# Altium project Power Board V1.PrjPcb
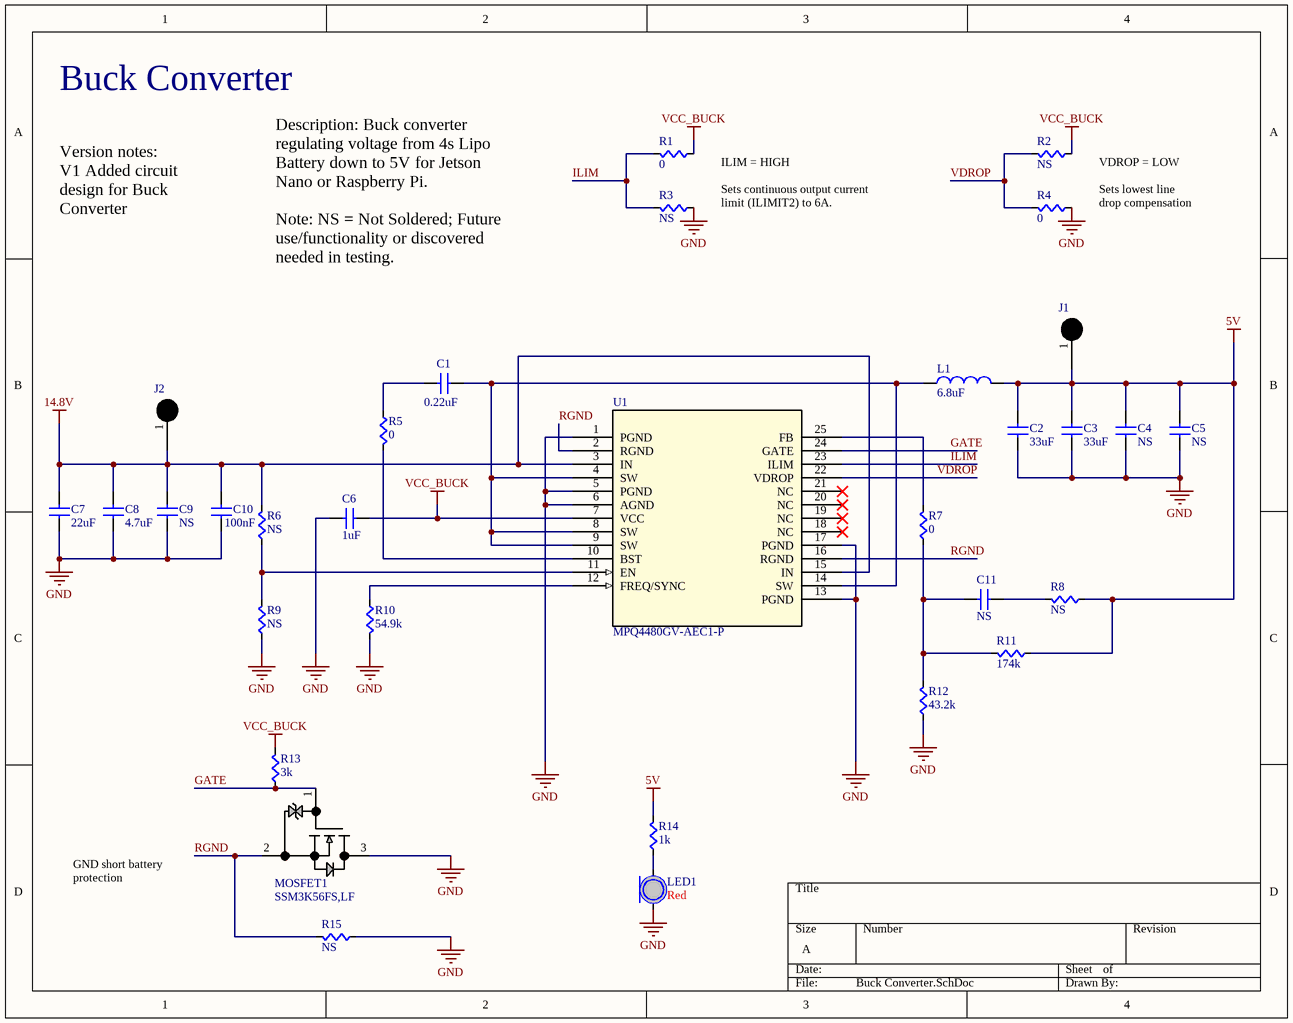
[diagram p0: Buck Converter.SchDoc]
3 sheets, 56 parts. Net scope: global (net labels, ports and power ports of the same name join across sheets).
Board file: Power Board V2.PcbDoc
Sheets:
  Buck Converter.SchDoc
  Battery Management System.SchDoc
  Board Connector.SchDoc

## Sheet Buck Converter.SchDoc
size A; SheetNumber: 1; SheetTotal: 3

### Parts
C1  value 0.22uF  [CAPC0603]  (hidden comment: C1608X7R1H224K080AE)
C2  value 33uF  [CAP1210]  (hidden comment: C3225X5R1A336M200AC)
C3  value 33uF  [CAP1210]  (hidden comment: C3225X5R1A336M200AC)
C4  value NS  [CAPC1206]  (hidden comment: Cap)
C5  value NS  [CAPC1206]  (hidden comment: Cap)
C6  value 1uF  [CAPC0603]  (hidden comment: CL10A105KB8NNNC)
C7  value 22uF  [CAPC1206]  (hidden comment: CL31A226KAHNNNE)
C8  value 4.7uF  [CAPC1206]  (hidden comment: 885012208094)
C9  value NS  [CAPC1206]  (hidden comment: Cap)
C10  value 100nF  [CAPC0603]  (hidden comment: CL10B104KB8NNNC)
C11  value NS  [CAPC0603]  (hidden comment: Cap)
J1  5000 Test Point  [5000 Test Point]  (value not drawn)
J2  5000 Test Point  [5000 Test Point]  (value not drawn)
L1  Inductance: 6.8uF  [SRR1208 Series]  (hidden comment: SRR1280A-6R8Y)
LED1  Color: Red  [LED1206]  (hidden comment: LED)
MOSFET1  SSM3K56FS,LF  [SSM_TOS]
R1  value 0  [RES0603]  (hidden comment: RMCF0603ZT0R00)
R2  value NS  [RES0603]  (hidden comment: Res)
R3  value NS  [RES0603]  (hidden comment: Res)
R4  value 0  [RES0603]  (hidden comment: RMCF0603ZT0R00)
R5  value 0  [RES0603]  (hidden comment: RMCF0603ZT0R00)
R6  value NS  [RES0603]  (hidden comment: Res)
R7  value 0  [RES0603]  (hidden comment: RMCF0603ZT0R00)
R8  value NS  [RES0603]  (hidden comment: Res)
R9  value NS  [RES0603]  (hidden comment: Res)
R10  value 54.9k  [RES0603]  (hidden comment: RMCF0603FT54K9)
R11  value 174k  [RES0603]  (hidden comment: RC0603FR-07174KL)
R12  value 43.2k  [RES0603]  (hidden comment: RC0603FR-0743K2L)
R13  value 3k  [RES0603]  (hidden comment: RMCF0603FT3K00)
R14  value 1k  [RES0603]  (hidden comment: RC0603FR-071KL)
R15  value NS  [RES0603]  (hidden comment: Res)
U1  MPQ4480GV-AEC1-P  [QFN-25_4X5_MNP]

### Nets
5V: C2.1(A) C3.1(A) C4.1(A) C5.1(A) J1.1 L1.2(B) R8.2(B) R11.2(B) R14.1(A)
14.8V: C7.1(A) C8.1(A) C9.1(A) C10.1(A) J2.1 R6.1(A) U1.3(IN) U1.15(IN)
GND: C2.2(B) C3.2(B) C4.2(B) C5.2(B) C6.2(B) C7.2(B) C8.2(B) C9.2(B) C10.2(B) LED1.C MOSFET1.3 R3.2(B) R4.2(B) R9.2(B) R10.1(A) R12.2(B) R15.2(B) U1.1(PGND) U1.5(PGND) U1.6(AGND) U1.13(PGND) U1.17(PGND)
VCC_BUCK: C6.1(A) R1.2(B) R2.2(B) R13.1(A) U1.7(VCC)
GATE: MOSFET1.1 R13.2(B) U1.24(GATE)
ILIM: R1.1(A) R3.1(A) U1.23(ILIM)
RGND: MOSFET1.2 R15.1(A) U1.2(RGND) U1.16(RGND)
VDROP: R2.1(A) R4.1(A) U1.22(VDROP)
NetC1_1: C1.1(A) R5.2(B)
NetC1_2: C1.2(B) L1.1(A) U1.4(SW) U1.8(SW) U1.9(SW) U1.14(SW)
NetC11_1: C11.1(A) R7.2(B) R11.1(A) R12.1(A)
NetC11_2: C11.2(B) R8.1(A)
NetLED1_A: LED1.A R14.2(B)
NetR5_1: R5.1(A) U1.10(BST)
NetR6_2: R6.2(B) R9.1(A) U1.11(EN)
NetR7_1: R7.1(A) U1.25(FB)
NetR10_2: R10.2(B) U1.12(FREQ/SYNC)

Not connected (* = marked no-connect by the designer): U1 18(NC)* 19(NC)* 20(NC)* 21(NC)*

### Notes on the sheet
- Buck Converter
- ILIM = HIGH
  Sets continuous output current limit (ILIMIT2) to 6A.
- VDROP = LOW
  Sets lowest line drop compensation
- Version notes:
  V1 Added circuit design for Buck Converter
- Description: Buck converter regulating voltage from 4s Lipo Battery down to 5V for Jetson Nano or Raspberry Pi.
  Note: NS = Not Soldered; Future use/functionality or discovered needed in testing.
- GND short battery protection

### Library data of the parts
C1 = C1608X7R1H224K080AE: 0.22 µF ±10% 50V Ceramic Capacitor X7R 0603 (1608 Metric); Supplier 1: Arrow Electronics; Supplier Part Number 1: C1608X7R1H224K080AE; ComponentLink1Description: New link; ComponentLink1URL: *
C2 C3 = C3225X5R1A336M200AC: 33 µF ±20% 10V Ceramic Capacitor X5R 1210 (3225 Metric); Supplier 1: Arrow Electronics; Supplier Part Number 1: C3225X5R1A336M200AC; ComponentLink1Description: New link; ComponentLink1URL: *
C6 = CL10A105KB8NNNC: 1 µF ±10% 50V Ceramic Capacitor X5R 0603 (1608 Metric); Supplier 1: Arrow Electronics; Supplier Part Number 1: CL10A105KB8NNNC; ComponentLink1Description: New link; ComponentLink1URL: *
C7 = CL31A226KAHNNNE: 22 µF ±10% 25V Ceramic Capacitor X5R 1206 (3216 Metric); Supplier 1: Arrow Electronics; Supplier Part Number 1: CL31A226KAHNNNE; ComponentLink1Description: New link; ComponentLink1URL: *
C8 = 885012208094: 4.7 µF ±10% 50V Ceramic Capacitor X7R 1206 (3216 Metric); Supplier 1: Digi-Key; Supplier Part Number 1: 732-7578-1-ND; ComponentLink1Description: New link; ComponentLink1URL: *
C9 = Cap: Not Soldered (NS); ComponentLink1Description: New link; ComponentLink1URL: *
C10 = CL10B104KB8NNNC: 0.1 µF ±10% 50V Ceramic Capacitor X7R 0603 (1608 Metric); Supplier 1: Arrow Electronics; Supplier Part Number 1: CL10B104KB8NNNC; ComponentLink1Description: New link; ComponentLink1URL: *
L1 = SRR1280A-6R8Y: FIXED IND 6.8UH 7.6A 18.5MOHM SM; Manufacturer 1: Bourns Inc; Manufacturer Part Number 1: SRR1280A-6R8Y; Supplier 1: Newark; Supplier Part Number 1: 87X9503
MOSFET1 = SSM3K56FS,LF: No Description Available; Mfr_Name: Toshiba Electronic Devices & Storage Corp.; Copyright: Copyright (C) 2023 Ultra Librarian. All rights reserved.; Manufacturer_Part_Number: SSM3K56FS,LF; RefDes: RefDes; Type: DEV
R1 R4 R5 R7 = RMCF0603ZT0R00: 0 Ohms Jumper Chip Resistor 0603 (1608 Metric) Automotive AEC-Q200 Thick Film; Supplier 1: Arrow Electronics; Supplier Part Number 1: RMCF0603ZT0R00
R10 = RMCF0603FT54K9: 54.9 kOhms ±1% 0.1W, 1/10W Chip Resistor 0603 (1608 Metric) Automotive AEC-Q200 Thick Film; Supplier 1: Arrow Electronics; Supplier Part Number 1: RMCF0603FT54K9
R11 = RC0603FR-07174KL: 174 kOhms ±1% 0.1W, 1/10W Chip Resistor 0603 (1608 Metric) Moisture Resistant Thick Film; Supplier 1: Future Electronics; Supplier Part Number 1: 4022323
R12 = RC0603FR-0743K2L: 43.2 kOhms ±1% 0.1W, 1/10W Chip Resistor 0603 (1608 Metric) Moisture Resistant Thick Film; Supplier 1: Future Electronics; Supplier Part Number 1: 3526589
R13 = RMCF0603FT3K00: 3 kOhms ±1% 0.1W, 1/10W Chip Resistor 0603 (1608 Metric) Automotive AEC-Q200 Thick Film; Supplier 1: Arrow Electronics; Supplier Part Number 1: RMCF0603FT3K00
R14 = RC0603FR-071KL: 1 kOhms ±1% 0.1W, 1/10W Chip Resistor 0603 (1608 Metric) Moisture Resistant Thick Film; Supplier 1: Future Electronics; Supplier Part Number 1: 4016291; Parameter 1: *
U1 = MPQ4480GV-AEC1-P: No Description Available; Mfr_Name: Monolithic Power Systems; Copyright: Copyright (C) 2023 Ultra Librarian. All rights reserved.; Manufacturer_Part_Number: MPQ4480GV-AEC1-P; Digi-Key_Part_Number_1: 1589-MPQ4480GV-AEC1-PTR-ND; Digi-Key_Part_Number_2: 1589-MPQ4480GV-AEC1-PCT-ND; Digi-Key_Part_Number_3: 1589-MPQ4480GV-AEC1-PDKR-ND; RefDes: RefDes; Type: DEV
C4 C5 C11 = Cap: Supplier 1: Digi-Key; Supplier Part Number 1: 1276-1000-1-ND; ComponentLink1Description: New link; ComponentLink1URL: *
LED1 = LED: Supplier 1: Digi-Key; Supplier Part Number 1: 1080-1419-1-ND
R2 R3 R6 R8 R9 R15 = Res: Supplier 1: Digi-Key; Supplier Part Number 1: RMCF0603JT10K0CT-ND

## Sheet Battery Management System.SchDoc
size A; SheetNumber: 2; SheetTotal: 3
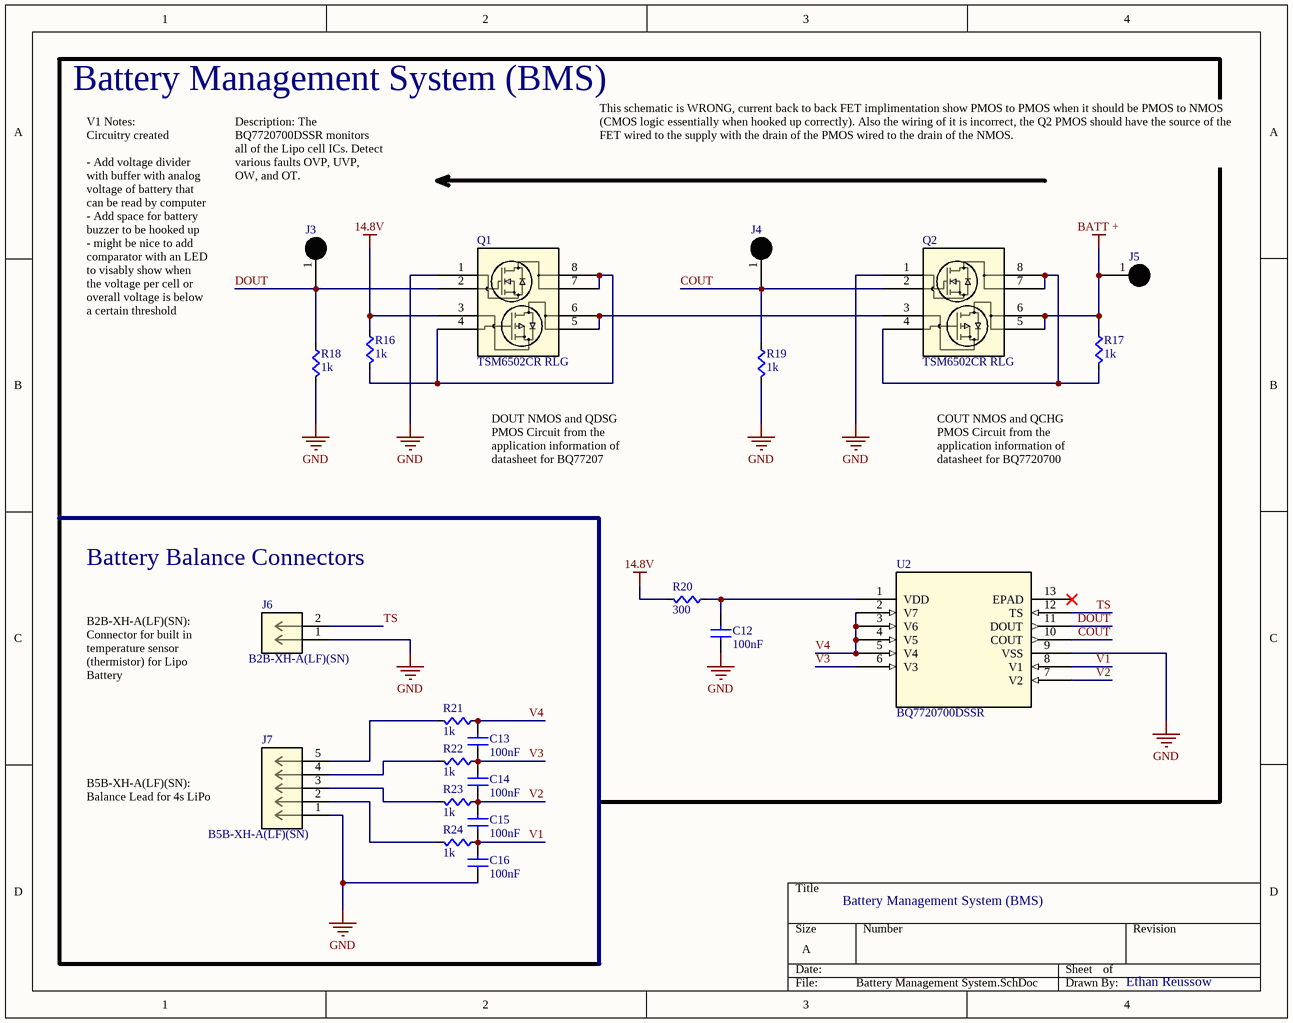
[diagram p1: Battery Management System.SchDoc]

### Parts
C12  value 100nF  [CAPC0603]  (hidden comment: Cap)
C13  value 100nF  [CAPC0603]  (hidden comment: Cap)
C14  value 100nF  [CAPC0603]  (hidden comment: Cap)
C15  value 100nF  [CAPC0603]  (hidden comment: Cap)
C16  value 100nF  [CAPC0603]  (hidden comment: Cap)
J3  5000 Test Point  [5000 Test Point]  (value not drawn)
J4  5000 Test Point  [5000 Test Point]  (value not drawn)
J5  5000 Test Point  [5000 Test Point]  (value not drawn)
J6  B2B-XH-A(LF)(SN)  [CONN_B2B-XH-A(LF)(SN)_JST]
J7  B5B-XH-A(LF)(SN)  [CONN_B5B-XH-A(LF)(SN)_JST]
Q1  TSM6502CR RLG  [PDFN56U_DUAL_TWS]
Q2  TSM6502CR RLG  [PDFN56U_DUAL_TWS]
R16  value 1k  [RES0603]  (hidden comment: Res)
R17  value 1k  [RES0603]  (hidden comment: Res)
R18  value 1k  [RES0603]  (hidden comment: Res)
R19  value 1k  [RES0603]  (hidden comment: Res)
R20  value 300  [RES0603]  (hidden comment: Res)
R21  value 1k  [RES0603]  (hidden comment: Res)
R22  value 1k  [RES0603]  (hidden comment: Res)
R23  value 1k  [RES0603]  (hidden comment: Res)
R24  value 1k  [RES0603]  (hidden comment: Res)
U2  BQ7720700DSSR  [WSON12_DSS_TEX]

### Nets
14.8V: Q1.3 R16.2(B) R20.1(A)
BATT +: J5.1 Q2.5 Q2.6 R17.2(B)
GND: C12.2(B) C16.2(B) J6.1 J7.1 Q1.1 Q2.1 R18.1(A) R19.1(A) U2.9(VSS)
COUT: J4.1 Q2.2 R19.2(B) U2.10(COUT)
DOUT: J3.1 Q1.2 R18.2(B) U2.11(DOUT)
TS: J6.2 U2.12(TS)
V1: C15.2(B) C16.1(A) R24.2(B) U2.8(V1)
V2: C14.2(B) C15.1(A) R23.2(B) U2.7(V2)
V3: C13.2(B) C14.1(A) R22.2(B) U2.6(V3)
V4: C13.1(A) R21.2(B) U2.2(V7) U2.3(V6) U2.4(V5) U2.5(V4)
NetC12_1: C12.1(A) R20.2(B) U2.1(VDD)
NetJ7_2: J7.2 R24.1(A)
NetJ7_3: J7.3 R23.1(A)
NetJ7_4: J7.4 R22.1(A)
NetJ7_5: J7.5 R21.1(A)
NetQ1_4: Q1.4 Q1.7 Q1.8 R16.1(A)
NetQ1_5: Q1.5 Q1.6 Q2.3
NetQ2_4: Q2.4 Q2.7 Q2.8 R17.1(A)

Not connected (* = marked no-connect by the designer): U2 13(EPAD)*

### Notes on the sheet
- Battery Management System (BMS)
- This schematic is WRONG, current back to back FET implimentation show PMOS to PMOS when it should be PMOS to NMOS (CMOS logic essentially when hooked up correctly). Also the wiring of it is incorrect, the Q2 PMOS should have the source of the FET wired to the supply with the drain of the PMOS wired to the drain of the NMOS.
- Flow of Power
- Description: The BQ7720700DSSR monitors all of the Lipo cell ICs. Detect various faults OVP, UVP, OW, and OT.
- V1 Notes:
  Circuitry created
  - Add voltage divider with buffer with analog voltage of battery that can be read by computer
  - Add space for battery buzzer to be hooked up
  - might be nice to add comparator with an LED to visably show when the voltage per cell or overall voltage is below a certain threshold
- DOUT NMOS and QDSG PMOS Circuit from the application information of datasheet for BQ77207
- (near R17) COUT NMOS and QCHG PMOS Circuit from the application information of datasheet for BQ7720700
- Battery Balance Connectors
- B2B-XH-A(LF)(SN): Connector for built in temperature sensor (thermistor) for Lipo Battery
- B5B-XH-A(LF)(SN):
  Balance Lead for 4s LiPo
- Ethan Reussow

### Library data of the parts
J6 = B2B-XH-A(LF)(SN): No Description Available; Mfr_Name: JST; Copyright: Copyright (C) 2023 Ultra Librarian. All rights reserved.; Manufacturer_Part_Number: B2B-XH-A(LF)(SN); RefDes: RefDes; Type: DEV
J7 = B5B-XH-A(LF)(SN): No Description Available; Mfr_Name: JST; Copyright: Copyright (C) 2023 Ultra Librarian. All rights reserved.; Manufacturer_Part_Number: B5B-XH-A(LF)(SN); RefDes: RefDes; Type: DEV
Q1 Q2 = TSM6502CR RLG: No Description Available; Mfr_Name: Taiwan Semiconductor; Type: DEV; Copyright: Copyright (C) 2023 Ultra Librarian. All rights reserved.; Manufacturer_Part_Number: TSM6502CR RLG; RefDes: RefDes
U2 = BQ7720700DSSR: No Description Available; Mfr_Name: Texas Instruments; Copyright: Copyright (C) 2023 Ultra Librarian. All rights reserved.; Manufacturer_Part_Number: BQ7720700DSSR; RefDes: RefDes; Type: DEV
C12-C16 = Cap: Supplier 1: Digi-Key; Supplier Part Number 1: 1276-1000-1-ND; ComponentLink1Description: New link; ComponentLink1URL: *
R16-R24 = Res: Supplier 1: Digi-Key; Supplier Part Number 1: RMCF0603JT10K0CT-ND

## Sheet Board Connector.SchDoc
size A; SheetNumber: 3; SheetTotal: 3
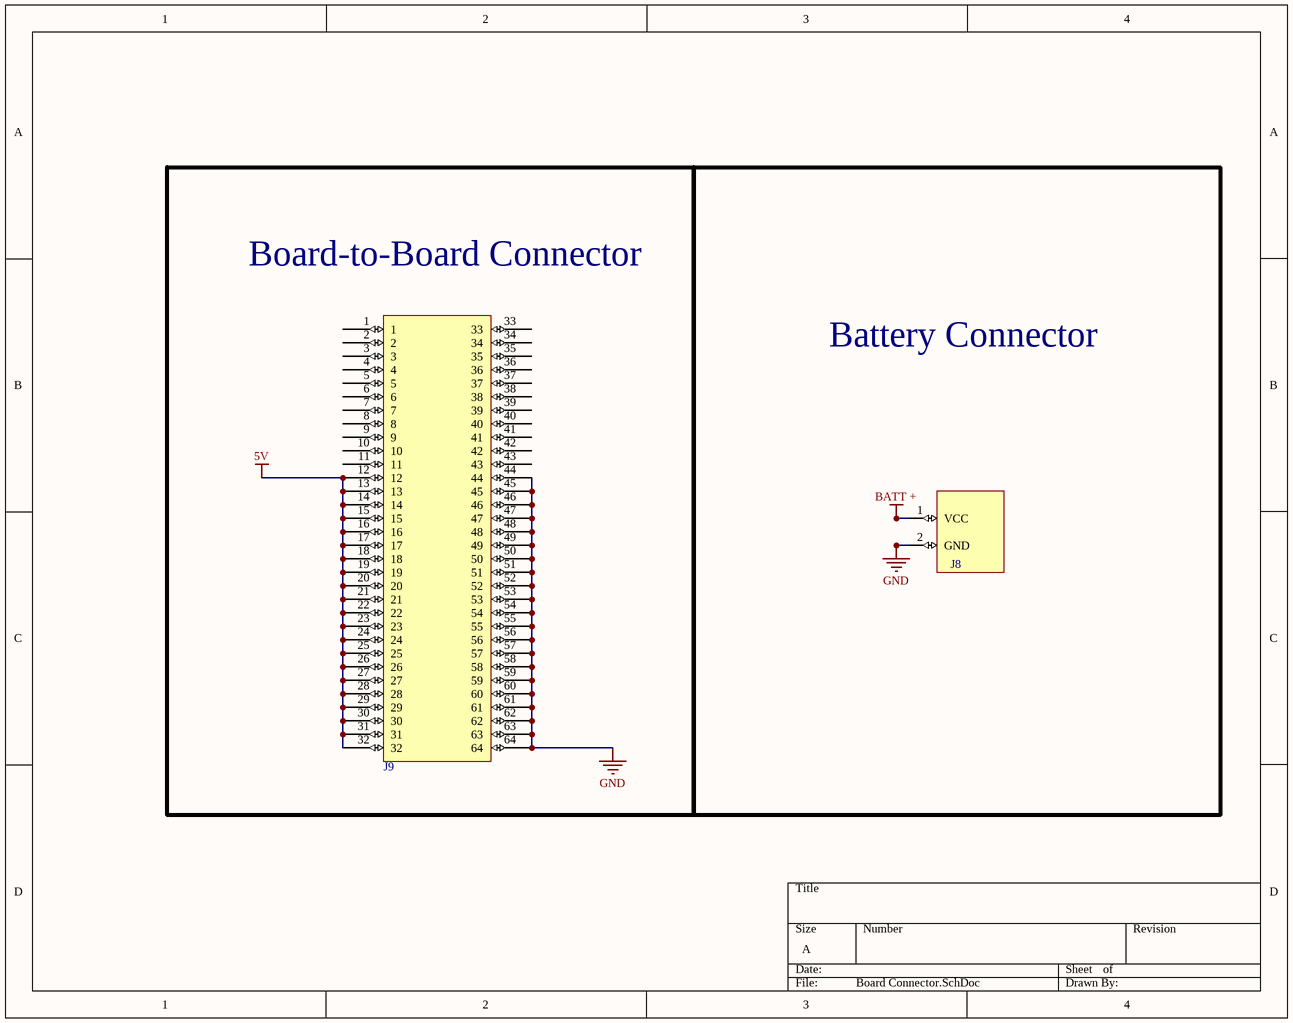
[diagram p2: Board Connector.SchDoc]

### Parts
J8  Surface Mount Pad to solder battery connector wires from power bus bar  [Battery Connector]  (value not drawn)
J9  0714392464  [1.0mm mezzanine connector 64 pin]  (value not drawn)

### Blocks framed on the sheet
Board-to-Board Connector: J9
Battery Connector: J8

### Nets
5V: J9.12 J9.13 J9.14 J9.15 J9.16 J9.17 J9.18 J9.19 J9.20 J9.21 J9.22 J9.23 J9.24 J9.25 J9.26 J9.27 J9.28 J9.29 J9.30 J9.31 J9.32
BATT +: J8.1(VCC)
GND: J8.2(GND) J9.44 J9.45 J9.46 J9.47 J9.48 J9.49 J9.50 J9.51 J9.52 J9.53 J9.54 J9.55 J9.56 J9.57 J9.58 J9.59 J9.60 J9.61 J9.62 J9.63 J9.64

Not connected (* = marked no-connect by the designer): J9 1 2 3 4 5 6 7 8 9 10 11 33 34 35 36 37 38 39 40 41 42 43

### Library data of the parts
J8 = Battery Connector: Battery connector from bus bar to board
J9 = 0714392464: 64 Position Connector Receptacle, Outer Shroud Contacts Surface Mount Gold

## Nets that join several sheets
5V: Buck Converter (9 pins), Board Connector (21 pins)
14.8V: Buck Converter (8 pins), Battery Management System (Q1.3 R16.2 R20.1)
BATT +: Battery Management System (J5.1 Q2.5 Q2.6 R17.2), Board Connector (J8.1)
GND: Buck Converter (22 pins), Battery Management System (9 pins), Board Connector (22 pins)